# EAGLE design Engine_Stroke (EAGLE 9.6.2)
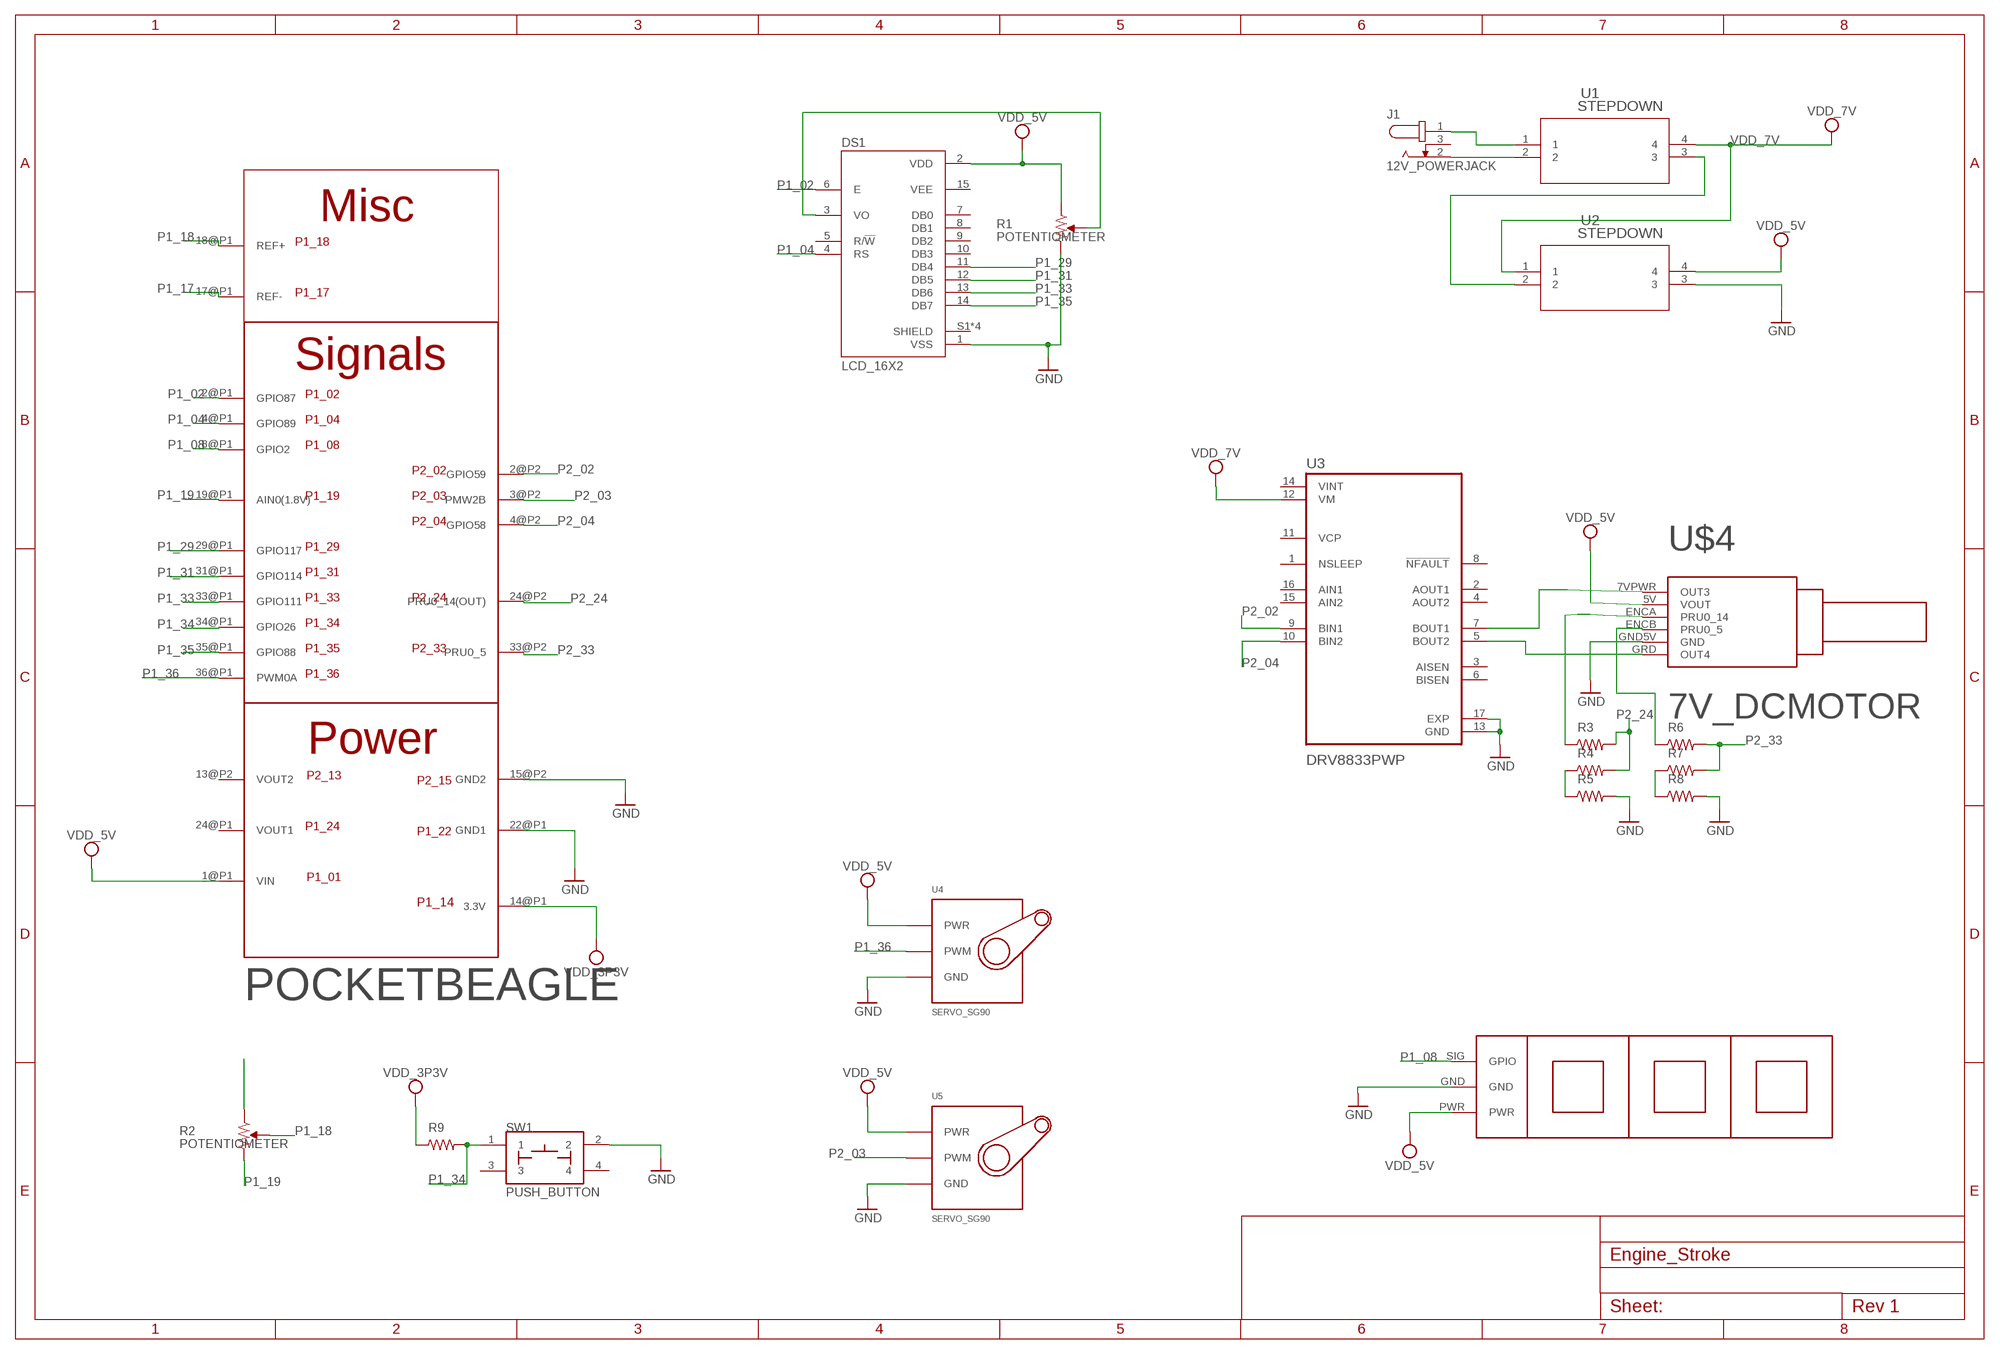
[diagram p0: schematic, sheet 1]

## Parts
DS1  LCD_16X2  [LCD_RC1602B-BIW-CSV]
J1  12V_POWERJACK  [CUI_PJ-102BH]
R1  POTENTIOMETER  [POT-PO90S]
R2  POTENTIOMETER  [POT-PO90S]
R3  R_R0603  [R0603]
R4  R_R0603  [R0603]
R5  R_R0603  [R0603]
R6  R_R0603  [R0603]
R7  R_R0603  [R0603]
R8  R_R0603  [R0603]
R9  R_R0603  [R0603]
SW1  PUSH_BUTTON  [BUTTON_12.5MM]
U1  STEPDOWN  [IC4_DFR0067_DFR]
U2  STEPDOWN  [IC4_DFR0067_DFR]
U3  DRV8833PWP  [IC_DRV8833PWP]
U4  SERVO_SG90  [SERVO-X1]
U5  SERVO_SG90  [SERVO-X1]
U$1  POCKETBEAGLE  [POCKETBEAGLE]
U$3  RGB_LED_STRIP  [LED_STRIP]
U$4  7V_DCMOTOR  [7V_DCMOTOR]

## Nets
GND: DS1.1(VSS) R1.CW R5.2 R8.2 SW1.2 U2.3 U3.13(GND) U3.17(EXP) U4.GND U5.GND U$1.15@P2(GND2) U$1.22@P1(GND1) U$3.GND U$4.GND5V(GND)
N$1: J1.1 U1.1
N$2: J1.2 U1.2
N$3: U1.3 U2.2
N$4: U3.7(BOUT1) U$4.7VPWR(OUT3)
N$5: U3.5(BOUT2) U$4.GRD(OUT4)
N$13: R3.1 U$4.ENCA(PRU0_14)
N$15: R4.1 R5.1
N$16: DS1.3(VO) R1.S
N$17: R6.1 U$4.ENCB(PRU0_5)
N$19: R7.1 R8.1
P1_02: DS1.6(E) U$1.2@P1(GPIO87)
P1_04: DS1.4(RS) U$1.4@P1(GPIO89)
P1_08: U$1.8@P1(GPIO2) U$3.SIG(GPIO)
P1_17: R2.CCW U$1.17@P1(REF-)
P1_18: R2.S U$1.18@P1(REF+)
P1_19: R2.CW U$1.19@P1(AIN0(1.8V))
P1_29: DS1.11(DB4) U$1.29@P1(GPIO117)
P1_31: DS1.12(DB5) U$1.31@P1(GPIO114)
P1_33: DS1.13(DB6) U$1.33@P1(GPIO111)
P1_34: R9.2 SW1.1 U$1.34@P1(GPIO26)
P1_35: DS1.14(DB7) U$1.35@P1(GPIO88)
P1_36: U4.SIG(PWM) U$1.36@P1(PWM0A)
P2_02: U3.9(BIN1) U$1.2@P2(GPIO59)
P2_03: U5.SIG(PWM) U$1.3@P2(PMW2B)
P2_04: U3.10(BIN2) U$1.4@P2(GPIO58)
P2_24: R3.2 R4.2 U$1.24@P2(PRU0_14(OUT))
P2_33: R6.2 R7.2 U$1.33@P2(PRU0_5)
VDD_3P3V: R9.1 U$1.14@P1(3.3V)
VDD_5V: DS1.2(VDD) R1.CCW U2.4 U3.12(VM) U4.PWR U5.PWR U$1.1@P1(VIN) U$3.PWR U$4.5V(VOUT) ; supply symbol labelled VDD_7V
VDD_7V: U1.4 U2.1
Unconnected: DS1.5(R/!W) DS1.7(DB0) DS1.8(DB1) DS1.9(DB2) DS1.10(DB3) DS1.15(VEE) DS1.S1(SHIELD) DS1.S2(SHIELD) DS1.S3(SHIELD) DS1.S4(SHIELD) J1.3 SW1.3 SW1.4 U3.1(NSLEEP) U3.2(AOUT1) U3.3(AISEN) U3.4(AOUT2) U3.6(BISEN) U3.8(!NFAULT) U3.11(VCP) U3.15(AIN2) U3.16(AIN1) U$1.13@P2(VOUT2) U$1.24@P1(VOUT1)

## Power pins joined to a net without a drawn wire
VINT: U3.14(VINT)

## Library data of the parts
DS1 = engine_stroke_model:LCD_16X2: Display: LCD; alphanumeric; STN Negative; 16x2; blue; LED; PIN: 16 Check availability <https://pricing.snapeda.com/parts/RC1602B-BIW-CSV/Raystar/view-part?ref=eda>; AVAILABILITY: Not in stock; DESCRIPTION: Display: LCD; alphanumeric; STN Negative; 16x2; blue; LED; PIN: 16; MF: Raystar; MP: RC1602B-BIW-CSV; PACKAGE: None; PRICE: None
J1 = engine_stroke_model:12V_POWERJACK: 2.5 mm Center Pin, 5.0 A, Right Angle, Through Hole, Tapered Pins, Dc Power Jack Connector Check availability <https://pricing.snapeda.com/parts/PJ-102BH/CUI%20Devices/view-part?ref=eda>; AVAILABILITY: In Stock; CUI_PURCHASE_URL: https://www.cuidevices.com/product/interconnect/connectors/dc-power-connectors/jacks/pj-102bh?utm_source=snapeda.com&utm_medium=referral&utm_campaign=snapedaBOM; DESCRIPTION: 2.5 x 6.5 mm, 5.0 A, Horizontal, Through Hole, Tapered Pins, Dc Power Jack Connector; MF: CUI Devices; MP: PJ-102BH; PACKAGE: None; PRICE: None; PURCHASE-URL: https://pricing.snapeda.com/search/part/PJ-102BH/?ref=eda
R1 R2 = engine_stroke_model:POTENTIOMETER: Potentiometer - Examples: P090S-14T20BR10K (987-1277-ND)
R3-R9 = engine_stroke_model:R_: RESISTOR, American symbol
SW1 = engine_stroke_model:PUSH_BUTTON
U1 U2 = engine_stroke_model:STEPDOWN; COPYRIGHT: Copyright (C) 2022 Ultra Librarian. All rights reserved.; MANUFACTURER_PART_NUMBER: DFR0067; MFR_NAME: DFRobot
U3 = engine_stroke_model:DRV8833PWP: 10.8-V, 2-A dual H-bridge motor driver with current regulation 16-HTSSOP -40 to 85 Check availability <https://pricing.snapeda.com/parts/DRV8833PWP/Texas%20Instruments/view-part?ref=eda>; AVAILABILITY: In Stock; DESCRIPTION: 10.8-V, 2-A dual H-bridge motor driver with current regulation; MF: Texas Instruments; MP: DRV8833PWP; PACKAGE: HTSSOP-16 Texas Instruments; PRICE: None; PURCHASE-URL: https://pricing.snapeda.com/search/part/DRV8833PWP/?ref=eda
U4 U5 = engine_stroke_model:SERVO_SG90
U$1 = engine_stroke_model:POCKETBEAGLE
U$3 = engine_stroke_model:RGB_LED_STRIP
U$4 = engine_stroke_model:7V_DCMOTOR

## Board
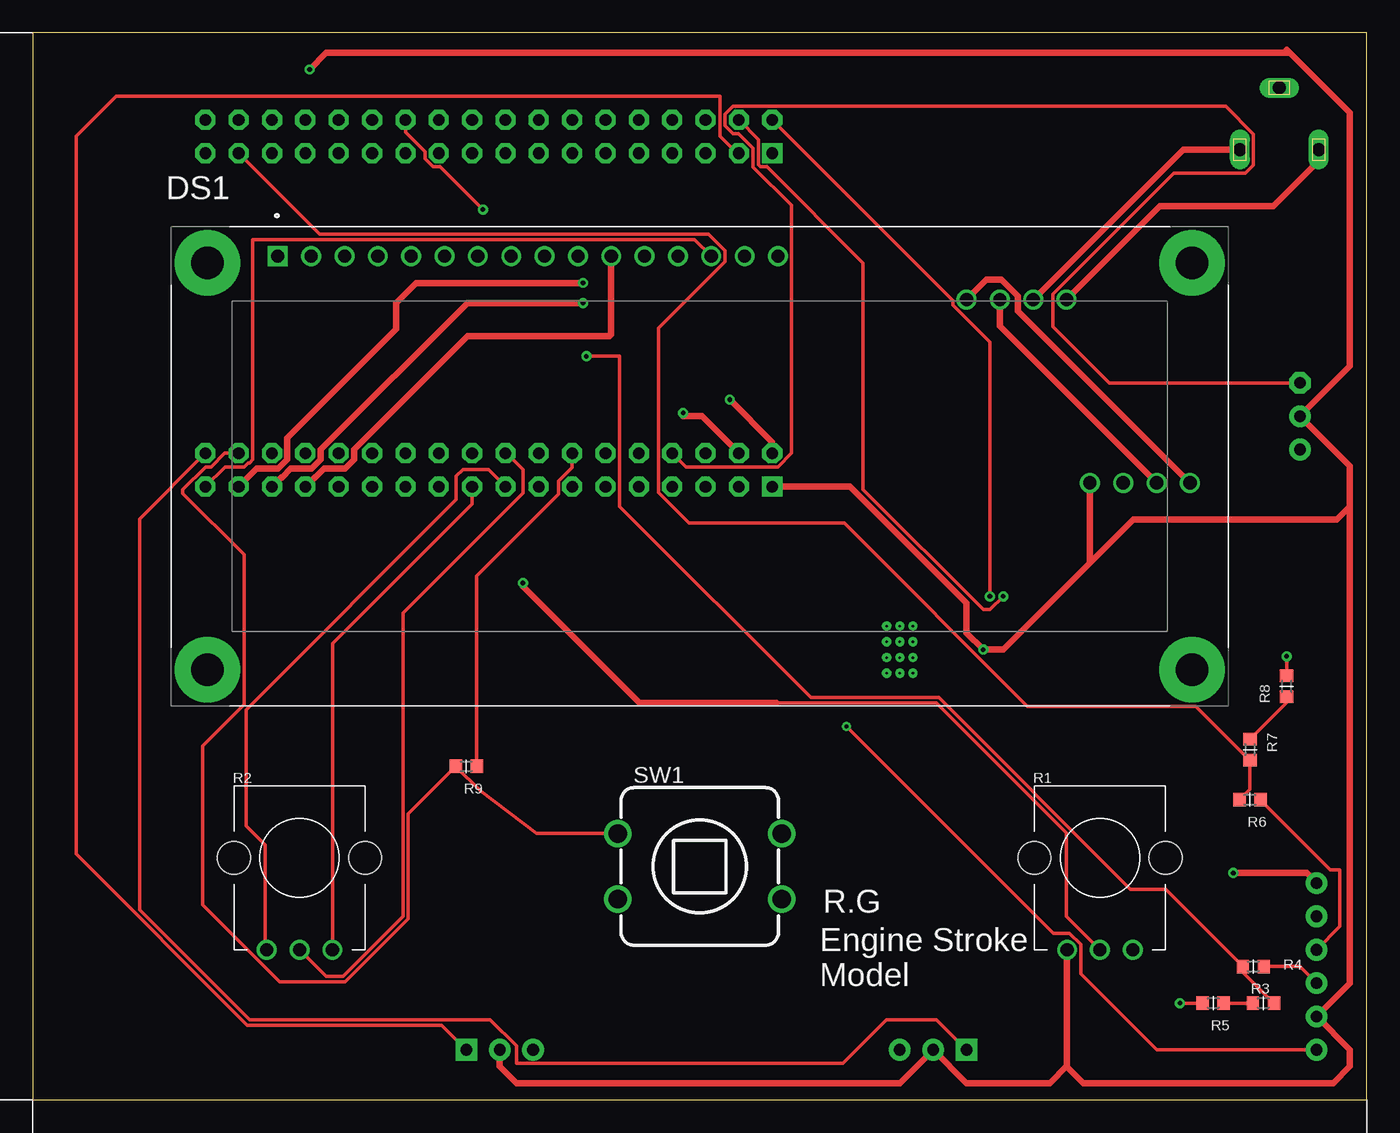
[diagram p1: board, top side]
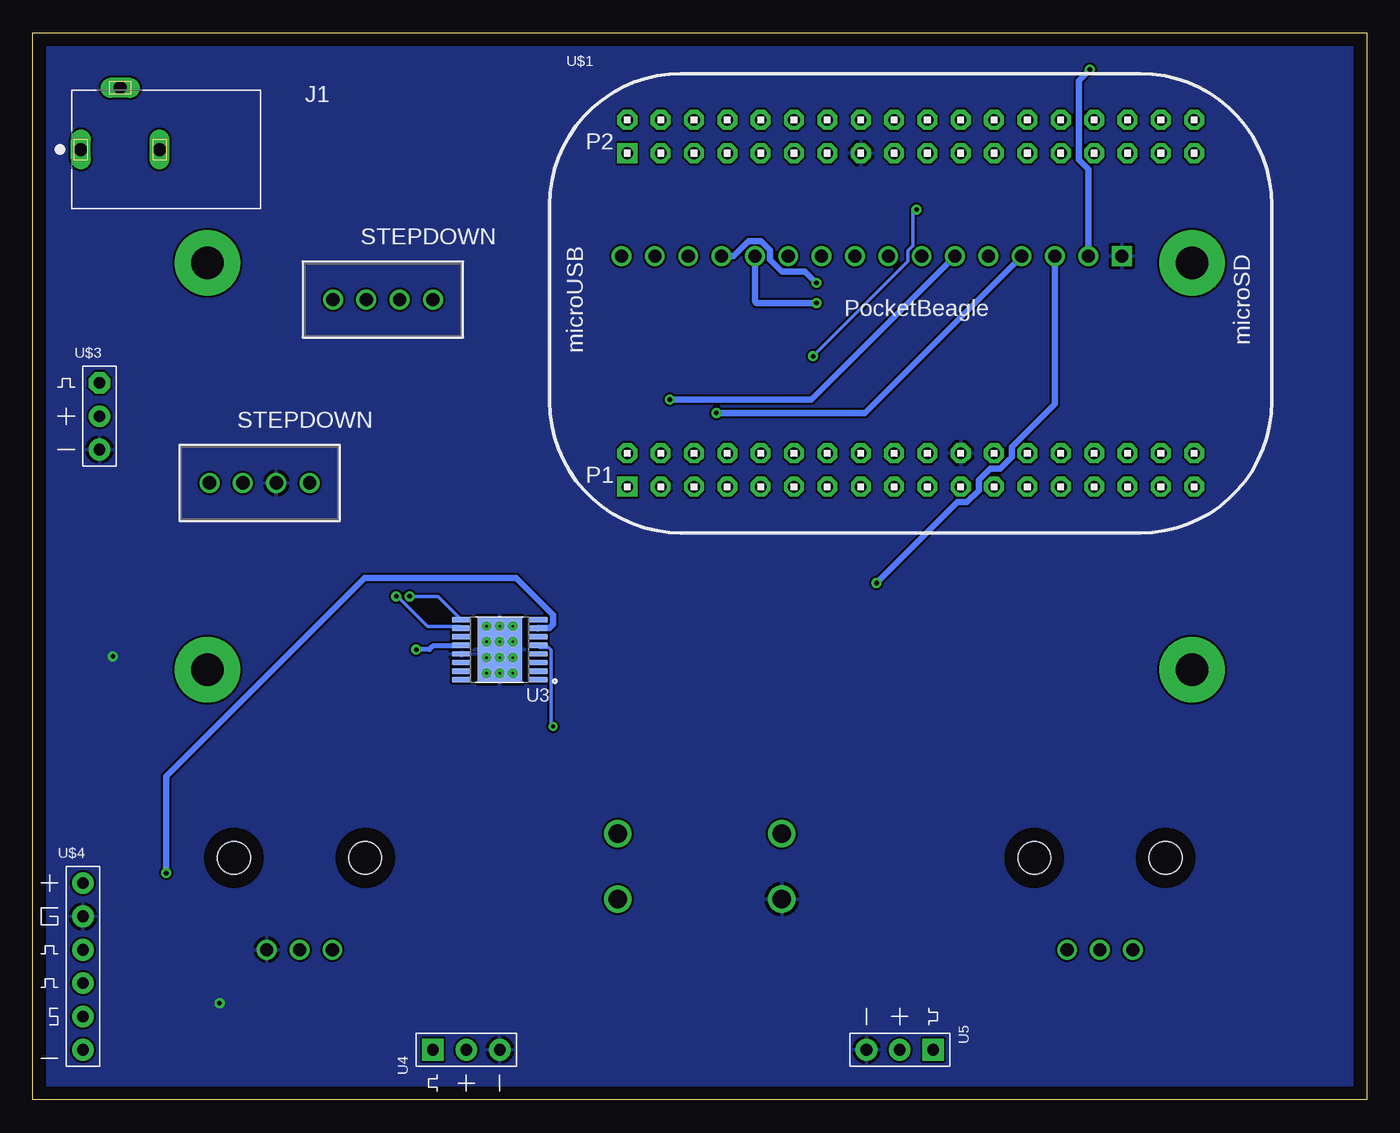
[diagram p2: board, bottom side, seen from below]

Size 101.6 x 81.28 mm. Coordinates in mm from the lower left corner, seen from the top.
Outline: 0,0 101.6,0 101.6,81.28 0,81.28 0,0
Copper layers (1*16): Top 0.035mm / dielectric 1.5mm / Bottom 0.035mm
Design rules "default": minimum track width 6mil, minimum drill 0.35mm, track to track 6mil, track to pad 6mil, pad to pad 6mil, via to via 6mil, smd to smd 6mil, copper to edge 40mil, drill to drill 6mil, minimum pad ring 10mil, minimum via ring 8mil, stop-mask expansion 4mil, vias tented up to drill 0mil, thermal gap 10mil

### Footprints (pad centres in the part's own frame; a part is rotated, then mirrored left to right if it is on the bottom)
LCD_RC1602B-BIW-CSV = drill 1 square: 1 -32.14,16 | drill 1: 2 -29.6,16; 3 -27.06,16; 4 -24.52,16; 5 -21.98,16; 6 -19.44,16; 7 -16.9,16; 8 -14.36,16; 9 -11.82,16; 10 -9.28,16; 11 -6.74,16; 12 -4.2,16; 13 -1.66,16; 14 0.88,16; 15 3.42,16; 16 5.96,16 | drill 2.5 pad 5: S1 -37.5,15.5; S2 37.5,15.5; S3 37.5,-15.5; S4 -37.5,-15.5
CUI_PJ-102BH = drill 1 long: 1 -6.5,0; 2 -0.5,0; 3 -3.5,4.7
POT-PO90S = drill 1: CCW -2.5,0; CW 2.5,0; S 0,0 | hole 2.5: -5,7; 5,7
R0603 = smd 0.95 x 1.031: 1 -0.8,0; 2 0.8,0
BUTTON_12.5MM = drill 1.4: 1 -6.25,2.5; 2 -6.25,-2.5; 3 6.25,2.5; 4 6.25,-2.5
IC4_DFR0067_DFR = drill 1.016 pad 1.524: 1 0,0; 2 2.54,0; 3 5.08,0; 4 7.62,0
IC_DRV8833PWP = smd 1.5 x 0.45: 1 -2.9,2.275; 2 -2.9,1.625; 3 -2.9,0.975; 4 -2.9,0.325; 5 -2.9,-0.325; 6 -2.9,-0.975; 7 -2.9,-1.625; 8 -2.9,-2.275; 9 2.9,-2.275; 10 2.9,-1.625; 11 2.9,-0.975; 12 2.9,-0.325; 13 2.9,0.325; 14 2.9,0.975; 15 2.9,1.625; 16 2.9,2.275 | smd 3.4 x 5: 17 0,0 | drill 0.2 pad 0.3: 18 -1,1.8; 19 0,1.8; 20 1,1.8; 21 -1,0.6; 22 0,0.6; 23 1,0.6; 24 -1,-0.6; 25 0,-0.6; 26 1,-0.6; 27 -1,-1.8; 28 0,-1.8; 29 1,-1.8
SERVO-X1 = drill 0.889 pad 1.651: GND 0,-2.54; PWR 0,0 | drill 0.889 pad 1.651 square: SIG 0,2.54
POCKETBEAGLE = drill 0.889 pad 1.524 square: 1@P1 5.91,3.53; 1@P2 5.91,28.93 | drill 0.889 pad 1.524 octagon: 2@P1 5.91,6.07; 2@P2 5.91,31.47; 3@P1 8.45,3.53; 3@P2 8.45,28.93; 4@P1 8.45,6.07; 4@P2 8.45,31.47; 5@P1 10.99,3.53; 5@P2 10.99,28.93; 6@P1 10.99,6.07; 6@P2 10.99,31.47; 7@P1 13.53,3.53; 7@P2 13.53,28.93; 8@P1 13.53,6.07; 8@P2 13.53,31.47; 9@P1 16.07,3.53; 9@P2 16.07,28.93; 10@P1 16.07,6.07; 10@P2 16.07,31.47; 11@P1 18.61,3.53; 11@P2 18.61,28.93; 12@P1 18.61,6.07; 12@P2 18.61,31.47; 13@P1 21.15,3.53; 13@P2 21.15,28.93; 14@P1 21.15,6.07; 14@P2 21.15,31.47; 15@P1 23.69,3.53; 15@P2 23.69,28.93; 16@P1 23.69,6.07; 16@P2 23.69,31.47; 17@P1 26.23,3.53; 17@P2 26.23,28.93; 18@P1 26.23,6.07; 18@P2 26.23,31.47; 19@P1 28.77,3.53; 19@P2 28.77,28.93; 20@P1 28.77,6.07; 20@P2 28.77,31.47; 21@P1 31.31,3.53; 21@P2 31.31,28.93; 22@P1 31.31,6.07; 22@P2 31.31,31.47; 23@P1 33.85,3.53; 23@P2 33.85,28.93; 24@P1 33.85,6.07; 24@P2 33.85,31.47; 25@P1 36.39,3.53; 25@P2 36.39,28.93; 26@P1 36.39,6.07; 26@P2 36.39,31.47; 27@P1 38.93,3.53; 27@P2 38.93,28.93; 28@P1 38.93,6.07; 28@P2 38.93,31.47; 29@P1 41.47,3.53; 29@P2 41.47,28.93; 30@P1 41.47,6.07; 30@P2 41.47,31.47; 31@P1 44.01,3.53; 31@P2 44.01,28.93; 32@P1 44.01,6.07; 32@P2 44.01,31.47; 33@P1 46.55,3.53; 33@P2 46.55,28.93; 34@P1 46.55,6.07; 34@P2 46.55,31.47; 35@P1 49.09,3.53; 35@P2 49.09,28.93; 36@P1 49.09,6.07; 36@P2 49.09,31.47
LED_STRIP = drill 0.889 pad 1.651: GND 1.27,1.27; PWR 1.27,3.81 | drill 0.889 pad 1.651 octagon: SIG 1.27,6.35
7V_DCMOTOR = drill 0.889 pad 1.651: 5V 1.27,-3.81; 7VPWR 1.27,6.35; ENCA 1.27,-1.27; ENCB 1.27,1.27; GND5V 1.27,3.81; GRD 1.27,-6.35

### Placement (x,y rotation side)
DS1  50.8,48.26 0 top
J1  91.44,72.39 0 bottom
R1  81.28,11.43 0 top
R2  20.32,11.43 0 top
R3  92.96,10.16 180 top
R4  93.73,7.37 0 top
R5  89.92,7.37 180 top
R6  92.71,22.86 180 top
R7  92.71,26.67 270 top
R8  95.5,31.5 90 top
R9  33.02,25.4 180 top
SW1  50.8,17.78 0 top
U1  78.74,60.96 0 bottom
U2  88.14,46.99 0 bottom
U3  66.04,34.29 180 bottom
U4  68.58,3.81 90 bottom
U5  35.56,3.81 270 bottom
U$1  62.23,43.18 0 bottom
U$3  97.79,48.26 0 bottom
U$4  99.06,10.16 0 bottom

### Tracks (layer width: path | path; a pad name or v marks a point on that pad's centre or on a via)
GND  (via drill 0.35, 0.35 pad 0.61)
  Top 0.254: R5.2 v87.38,7.37 | R8.2 v95.5,33.78
  pour Bottom: -5.08,-2.54 -5.08,81.28 -5.08,83.82 104.14,83.82 104.14,-5.08 -5.08,-5.08
N$1
  Top 0.508: U1.1 85.85,68.07 94.49,68.07 97.94,71.52 J1.1
N$2
  Top 0.508: U1.2 87.63,72.39 J1.2
N$3
  Top 0.508: U2.2 73.66,58.93 U1.3
N$4  (via drill 0.35)
  Top 0.508: v91.44,17.27 97.03,17.27 U$4.7VPWR
  Bottom 0.508: v91.44,17.27 91.44,24.64 76.34,39.74 64.8,39.74 61.98,36.92 61.98,36.2 62.26,35.93 63.12,35.93 U3.7
N$5  (via drill 0.3 pad 0.61)
  Top 0.254: U$4.GRD 85.6,3.81 79.81,9.6 79.81,11.86 78.97,12.7 78.23,12.7 77.72,12.7 v61.98,28.45
  Bottom 0.254: U3.5 62.99,34.47 62.31,34.47 62.11,34.27 62.11,28.58 v61.98,28.45
N$13
  Top 0.254: U$4.ENCA 96.52,10.16 R3.1
N$15
  Top 0.254: R5.1 R4.1
N$16  (via drill 0.35)
  Top 0.254: R1.S 78.74,13.97 78.74,20.32 68.83,30.23 56.64,30.23
  Top 0.508: 56.64,30.23 46.23,30.23 37.34,39.12 v37.34,39.37
  Bottom 0.508: v37.34,39.37 31.17,45.54 30.44,45.54 29.55,46.43 29.55,47.19 28.66,48.08 27.9,48.08 27.01,48.97 27.01,49.73 23.74,53 DS1.3
N$17
  Top 0.254: R6.1 98.84,17.53 99.57,17.53 99.57,13.21 U$4.ENCB
N$19
  Top 0.254: R7.1 95.5,30.26 R8.1
P1_02  (via drill 0.35)
  Top 0.508: v53.09,53.34 56.32,50.11 U$1.2@P1
  Bottom 0.508: DS1.6 42.28,53.34 v53.09,53.34
P1_04  (via drill 0.35)
  Top 0.508: U$1.4@P1 50.96,52.07 49.53,52.07 v49.53,52.32
  Bottom 0.508: v49.53,52.32 38.22,52.32 DS1.4
P1_08
  Top 0.254: U$1.8@P1 49.74,48.21 56.75,48.21 57.79,49.25 57.79,68.14 54.87,71.06 54.87,72.49 53.75,73.61 53.35,73.61 52.74,74.22 52.74,75.08 53.35,75.69 90.85,75.69 92.97,73.57 92.97,71.21 92.37,70.6 86.91,70.6 77.7,61.39 77.7,58.9 81.99,54.61 U$3.SIG
P1_17
  Top 0.254: U$1.17@P1 34.7,48.01 32.77,48.01 32.26,47.5 32.26,45.72 16.26,29.72 16.26,20.88 17.71,19.42 17.71,11.54 R2.CCW
P1_18
  Top 0.254: R2.S 22.35,9.4 23.62,9.4 28.19,13.97 28.19,37.08 37.34,46.23 37.34,48.01 36.09,49.25 U$1.18@P1
P1_19
  Top 0.254: R2.CW 22.82,34.76 33.46,45.4 U$1.19@P1
P1_29
  Top 0.508: U$1.29@P1 21.47,47.42 21.52,47.42 22.18,48.08 23.78,48.08 24.47,48.77 24.47,49.53 33.1,58.17 43.94,58.17 44.06,58.28 DS1.11
P1_31  (via drill 0.35)
  Top 0.508: U$1.31@P1 18.93,47.42 18.98,47.42 19.64,48.08 21.24,48.08 21.93,48.77 21.93,49.53 33.1,60.71 v41.91,60.71
  Bottom 0.508: v41.91,60.71 46.48,60.71 46.6,60.82 DS1.12
P1_33  (via drill 0.35)
  Top 0.508: U$1.33@P1 17.05,48.08 18.7,48.08 19.39,48.77 19.39,50.42 27.69,58.72 27.69,60.71 29.21,62.23 v41.91,62.23
  Bottom 0.508: v41.91,62.23 42.78,63.1 44.54,63.1 45.44,64 45.44,64.74 46.12,65.42 47.08,65.42 48.24,64.26 DS1.13
P1_34
  Top 0.254: SW1.1 38.35,20.28 34.1,23.52 R9.2 28.6,21.78 28.6,13.8 23.79,8.99 18.8,8.99 12.93,14.86 12.93,26.96 16.08,30.12 16.08,41.54 11.43,46.19 11.43,46.48 13.16,48.21 13.57,48.21 14.61,49.25 U$1.34@P1
P1_35
  Top 0.254: U$1.35@P1 14.64,48.21 16.11,48.21 16.42,48.51 16.51,48.51 16.76,48.77 16.76,65.53 50.41,65.53 DS1.14
P1_36
  Top 0.254: U$1.36@P1 8.13,44.24 8.13,14.48 16.51,6.1 34.84,6.1 36.83,4.1 36.83,2.79 61.72,2.79 65.02,6.1 68.83,6.1 U4.SIG
P2_02  (via drill 0.35)
  Top 0.254: U$1.2@P2 70.08,60.89 70.08,60.53 72.9,57.71 v72.9,38.35
  Bottom 0.254: U3.9 70.73,38.35 v72.9,38.35
P2_03
  Top 0.254: U5.SIG 31.14,5.69 16.34,5.69 3.3,18.73 3.3,73.41 6.35,76.45 52.32,76.45 52.32,73.41 53.62,72.11 U$1.3@P2
P2_04  (via drill 0.35)
  Top 0.254: v73.91,38.35 72.9,37.34 72.39,37.34 63.25,46.48 63.25,63.75 55.93,71.07 55.44,71.07 55.28,71.23 55.28,73.15 U$1.4@P2
  Bottom 0.254: U3.10 69.09,36.06 71.53,36.06 73.83,38.35 v73.91,38.35
P2_24  (via drill 0.35)
  Top 0.254: R4.2 92.16,9.73 R3.2 86.29,16.04 83.6,16.04 69,30.63 59.28,30.63 44.7,45.21 44.7,56.64 v42.16,56.64 | U$1.24@P2 28.38,73.73 29.88,72.23 29.88,71.68 30.49,71.07 31.04,71.07 v34.29,67.82
  Bottom 0.254: v42.16,56.64 34.93,63.87 34.93,64.69 34.54,65.08 34.54,67.82 v34.29,67.82
P2_33
  Top 0.254: R6.2 92.71,23.66 R7.2 88.6,29.98 75.77,29.98 61.81,43.94 49.99,43.94 47.66,46.28 47.66,58.78 52.71,63.83 52.71,64.69 51.46,65.94 21.85,65.94 U$1.33@P2
VDD_3P3V
  Top 0.254: R9.1 33.82,39.92 40.04,46.13 40.04,47.14 41.08,48.18 U$1.14@P1
VDD_5V  (via drill 0.35, 0.35 pad 0.61)
  Top 0.508: U5.PWR 35.56,2.54 36.83,1.27 66.04,1.27 U4.PWR 71.12,1.27 77.47,1.27 78.78,2.58 | R1.CCW 78.78,2.58 | 78.78,2.58 78.78,2.5 80.01,1.27 99.06,1.27 100.33,2.54 100.33,3.81 U$4.5V 100.33,8.89 100.33,45.21 | 100.33,45.21 100.33,48.26 U$3.PWR 100.33,55.88 100.33,75.18 95.76,79.76 | U$1.1@P1 62.26,46.71 71.12,37.85 71.12,35.56 v72.39,34.29 73.91,34.29 80.52,40.89 | 80.52,40.89 U2.4 | 80.52,40.89 83.82,44.2 99.31,44.2 100.33,45.21 | 95.76,79.76 95.5,80.01 | 20.74,64.26 DS1.2 | 95.76,79.76 22.35,79.76 v21.08,78.49
  Bottom 0.381: U3.12 68.96,34.6 71.09,34.6 71.4,34.29 v72.39,34.29
  Bottom 0.508: DS1.2 21.2,70.9 21.93,71.63 21.93,77.64 v21.08,78.49
VDD_7V
  Top 0.508: U1.4 72.64,62.48 73.79,62.48 75.03,61.24 75.03,60.1 U2.1

### Text on the board
tPlace: R.G | Engine Stroke / Model